# EAGLE design chipdoino (EAGLE 7.7.0)
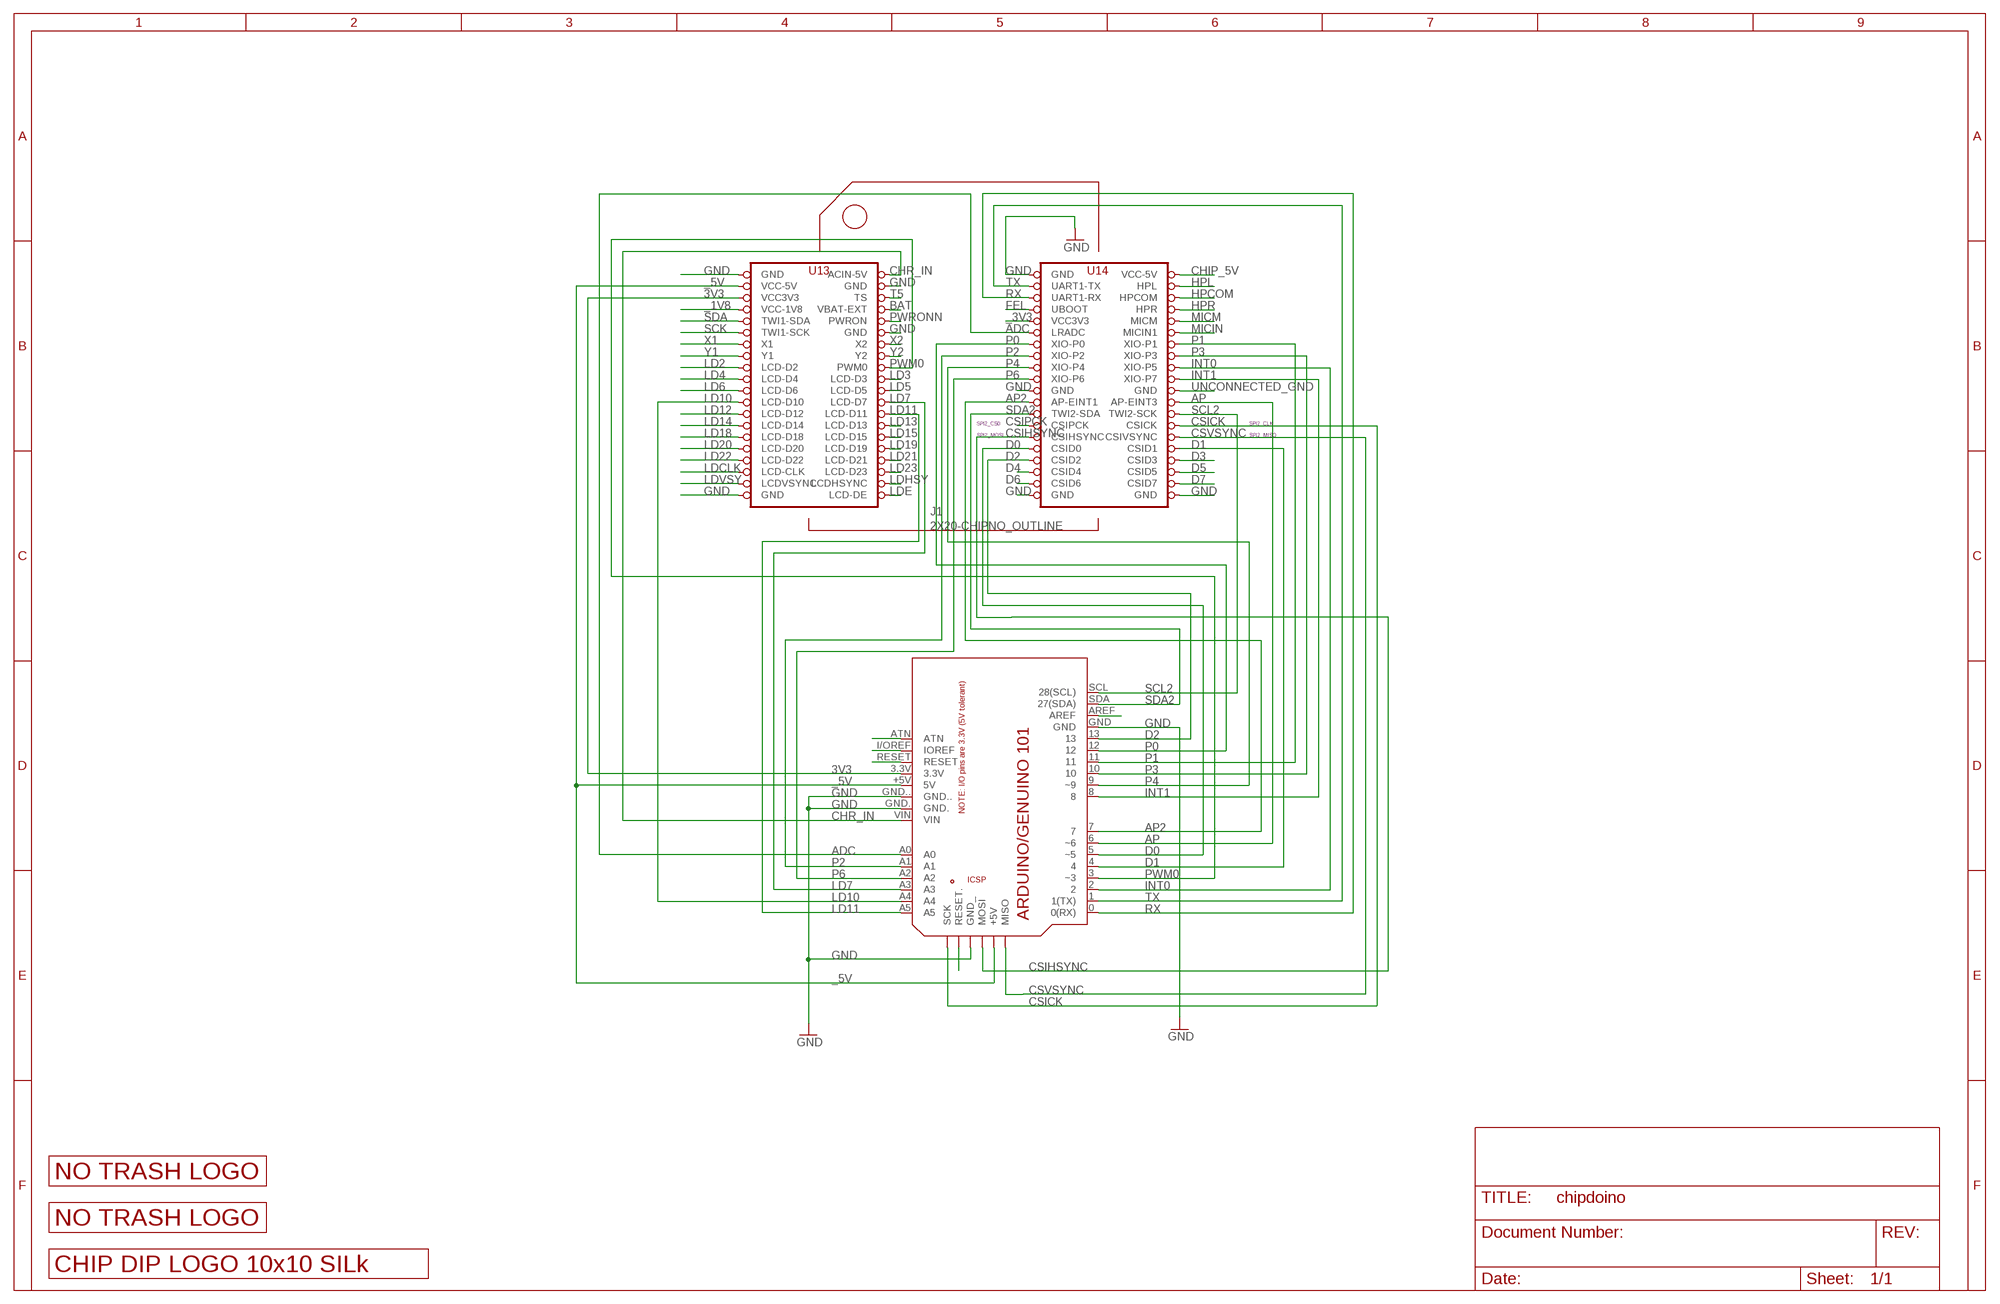
[diagram p0: schematic, sheet 1]

## Parts
J1  2X20-CHIPNO_OUTLINE  [2X20CHIP-TH_NO_OUTLINE]
PCB1  ARDUINO_101  [ARDUINO_101_PINSONLY]
U$2  LOGO_10X10_SILK  [LOGO2_10X10_SILK]
U$3  LOGO_NO_TRASHNO_TRASH  [LOGO_ROHS_NO_TRASH]
U$4  LOGO_NO_TRASHROHS  [LOGO_ROHS_SYM]

## Nets
3V3: J1.VCC3V3 PCB1.3.3V
_1V8: J1.VCC1V8(VCC-1V8)
_3V3: J1.VCC3V3@1(VCC3V3)
_5V: J1.VCC5V@0(VCC-5V) PCB1.5V(+5V) PCB1.+5V(5V)
ADC: J1.LRADC PCB1.A0
AP: J1.AP-EINT3 PCB1.6(~6)
AP2: J1.AP-EINT1 PCB1.7
BAT: J1.BAT(VBAT-EXT)
CHIP_5V: J1.VCC5V@1(VCC-5V)
CHR_IN: J1.CHG-IN(ACIN-5V) PCB1.VIN
CSICK: J1.CSICK PCB1.SCK
CSIHSYNC: J1.CSIHSYNC PCB1.MOSI
CSIPCK: J1.CSIPCK
CSVSYNC: J1.CSIVSYNC PCB1.MISO
D0: J1.CSID0 PCB1.5(~5)
D1: J1.CSID1 PCB1.4
D2: J1.CSID2 PCB1.13
D3: J1.CSID3
D4: J1.CSID4
D5: J1.CSID5
D6: J1.CSID6
D7: J1.CSID7
FEL: J1.FEL(UBOOT)
GND [gnd]: J1.GND@1(GND) J1.GND@2(GND) J1.GND@3(GND) J1.GND@4(GND) J1.GND@5(GND) J1.GND@6(GND) J1.GND@8(GND) J1.GND@10(GND) PCB1.GND PCB1.GND. PCB1.GND.. PCB1.GND_
HPCOM: J1.HPCOM
HPL: J1.HPL
HPR: J1.HPR
INT0: J1.XIO-P5 PCB1.2
INT1: J1.XIO-P7 PCB1.8
LD2: J1.LCD-D2
LD3: J1.LCD-D3
LD4: J1.LCD-D4
LD5: J1.LCD-D5
LD6: J1.LCD-D6
LD7: J1.LCD-D7 PCB1.A3
LD10: J1.LCD-D10 PCB1.A4
LD11: J1.LCD-D11 PCB1.A5
LD12: J1.LCD-D12
LD13: J1.LCD-D13
LD14: J1.LCD-D14
LD15: J1.LCD-D15
LD18: J1.LCD-D18
LD19: J1.LCD-D19
LD20: J1.LCD-D20
LD21: J1.LCD-D21
LD22: J1.LCD-D22
LD23: J1.LCD-D23
LDCLK: J1.LCD-CLK
LDE: J1.LCD-DE
LDHSY: J1.LCD-HSYNC(LCDHSYNC)
LDVSY: J1.LCD-VSYNC(LCDVSYNC)
MICIN: J1.MICIN1
MICM: J1.MICM
N$16: PCB1.AREF
N$30: PCB1.RESET
N$31: PCB1.I/OREF(IOREF)
N$32: PCB1.ATN
N$38: PCB1.RESET.
P0: J1.XIO-P0 PCB1.12
P1: J1.XIO-P1 PCB1.11
P2: J1.XIO-P2 PCB1.A1
P3: J1.XIO-P3 PCB1.10
P4: J1.XIO-P4 PCB1.9(~9)
P6: J1.XIO-P6 PCB1.A2
PWM0: J1.PWM0 PCB1.3(~3)
PWRONN: J1.PWRON
RX: J1.UART1-RX PCB1.0(0(RX))
SCK: J1.TWI1-SCK
SCL2: J1.TWI2-SCK PCB1.SCL(28(SCL))
SDA: J1.TWI1-SDA
SDA2: J1.TWI2-SDA PCB1.SDA(27(SDA))
T5: J1.TS
TX: J1.UART1-TX PCB1.1(1(TX))
UNCONNECTED_GND: J1.GND@7(GND)
X1: J1.X1
X2: J1.X2
Y1: J1.Y1
Y2: J1.Y2

## Notes on the sheet
- SPI2_CS0 | SPI2_CLK
- SPI2_MOSI | SPI2_MISO

## Library data of the parts
J1 = JKW_CHIP:2X20-CHIP: Chip header
PCB1 = E14_Arduino_revC:ARDUINO_101: Schematic symbol for representing an Arduino/Genuino 101 board in an EAGLE schematic. Created by Dave Young for Element14. More 101 documentation at: https://www.element14.com/community/docs/DOC-80459/l/intel-genuino-101-development-board More EAGLE documentation at: http://www.element14.com/community/community/knode/cadsoft_eagle
U$2 = JKW_CHIP:LOGO_10X10_SILK
U$3 U$4 = JKW_CHIP:LOGO_NO_TRASH

## Net classes
1 power: width 0.61 mm, drill 0.61 mm, clearance 0.254 mm
2 gnd: width 0.305 mm, drill 0.559 mm, clearance 0.254 mm
3 usbvcc: width 0.508 mm, drill 0.61 mm, clearance 0.254 mm
4 aref: width 0.406 mm, drill 0.61 mm, clearance 0.254 mm

## Board
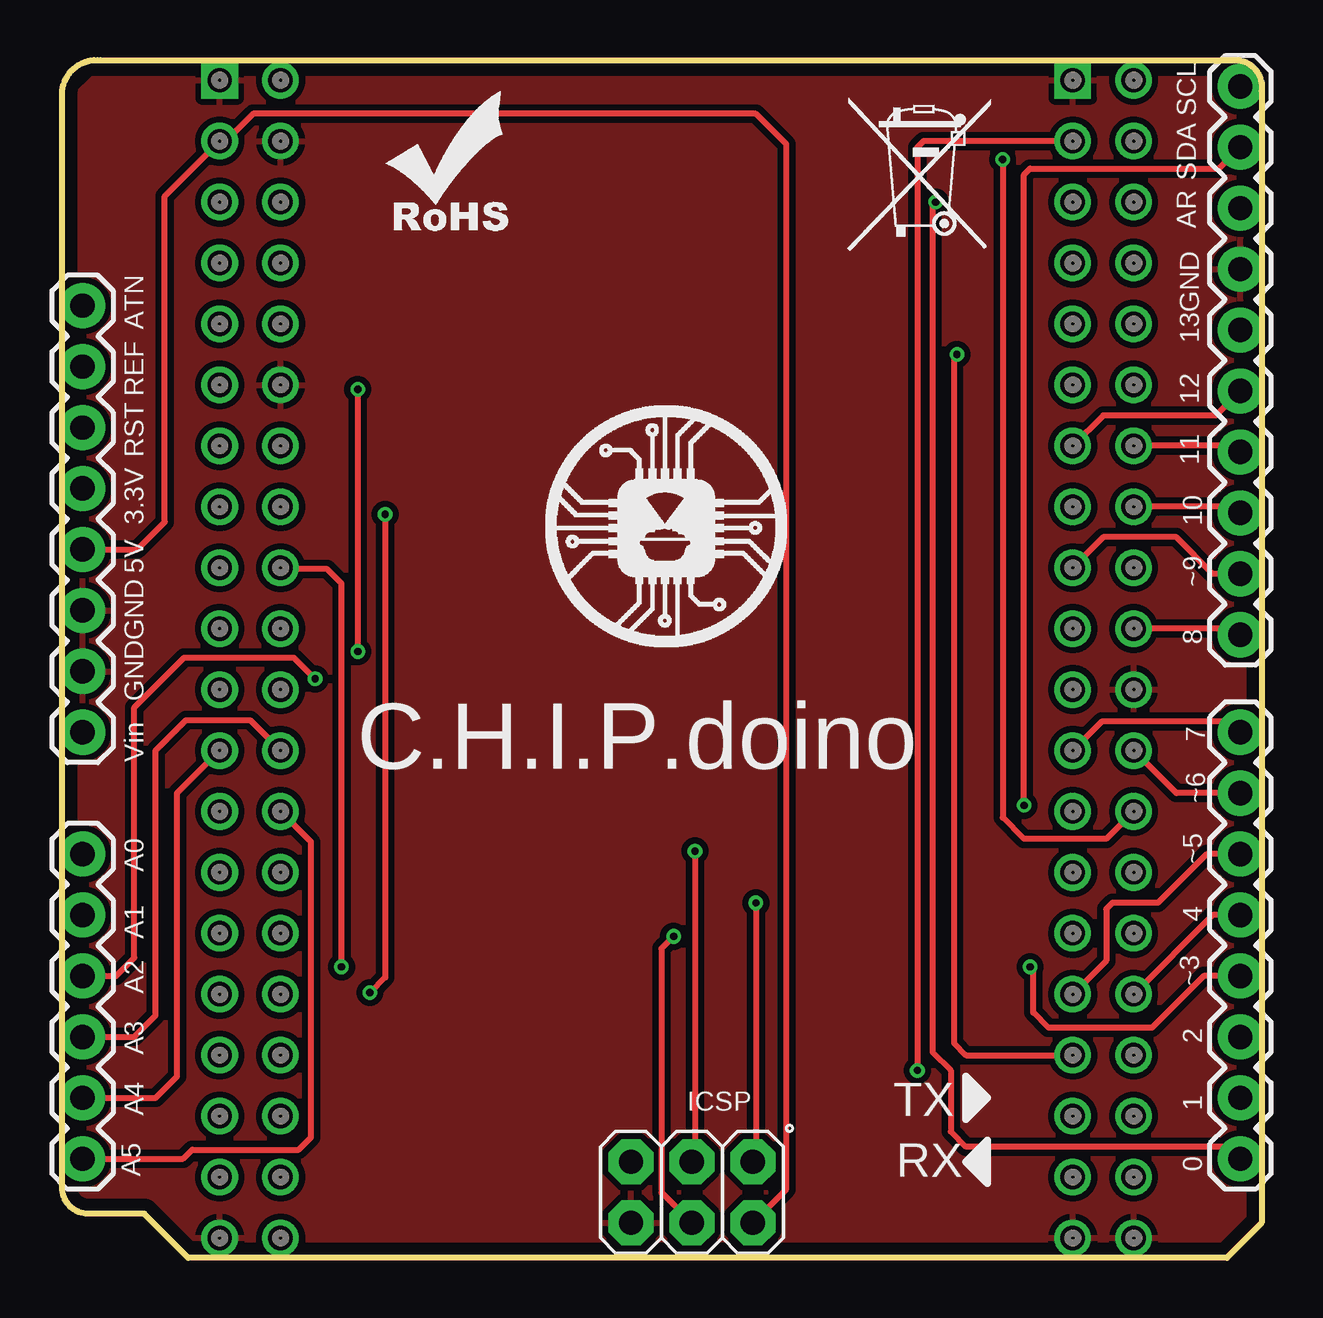
[diagram p1: board, top side]
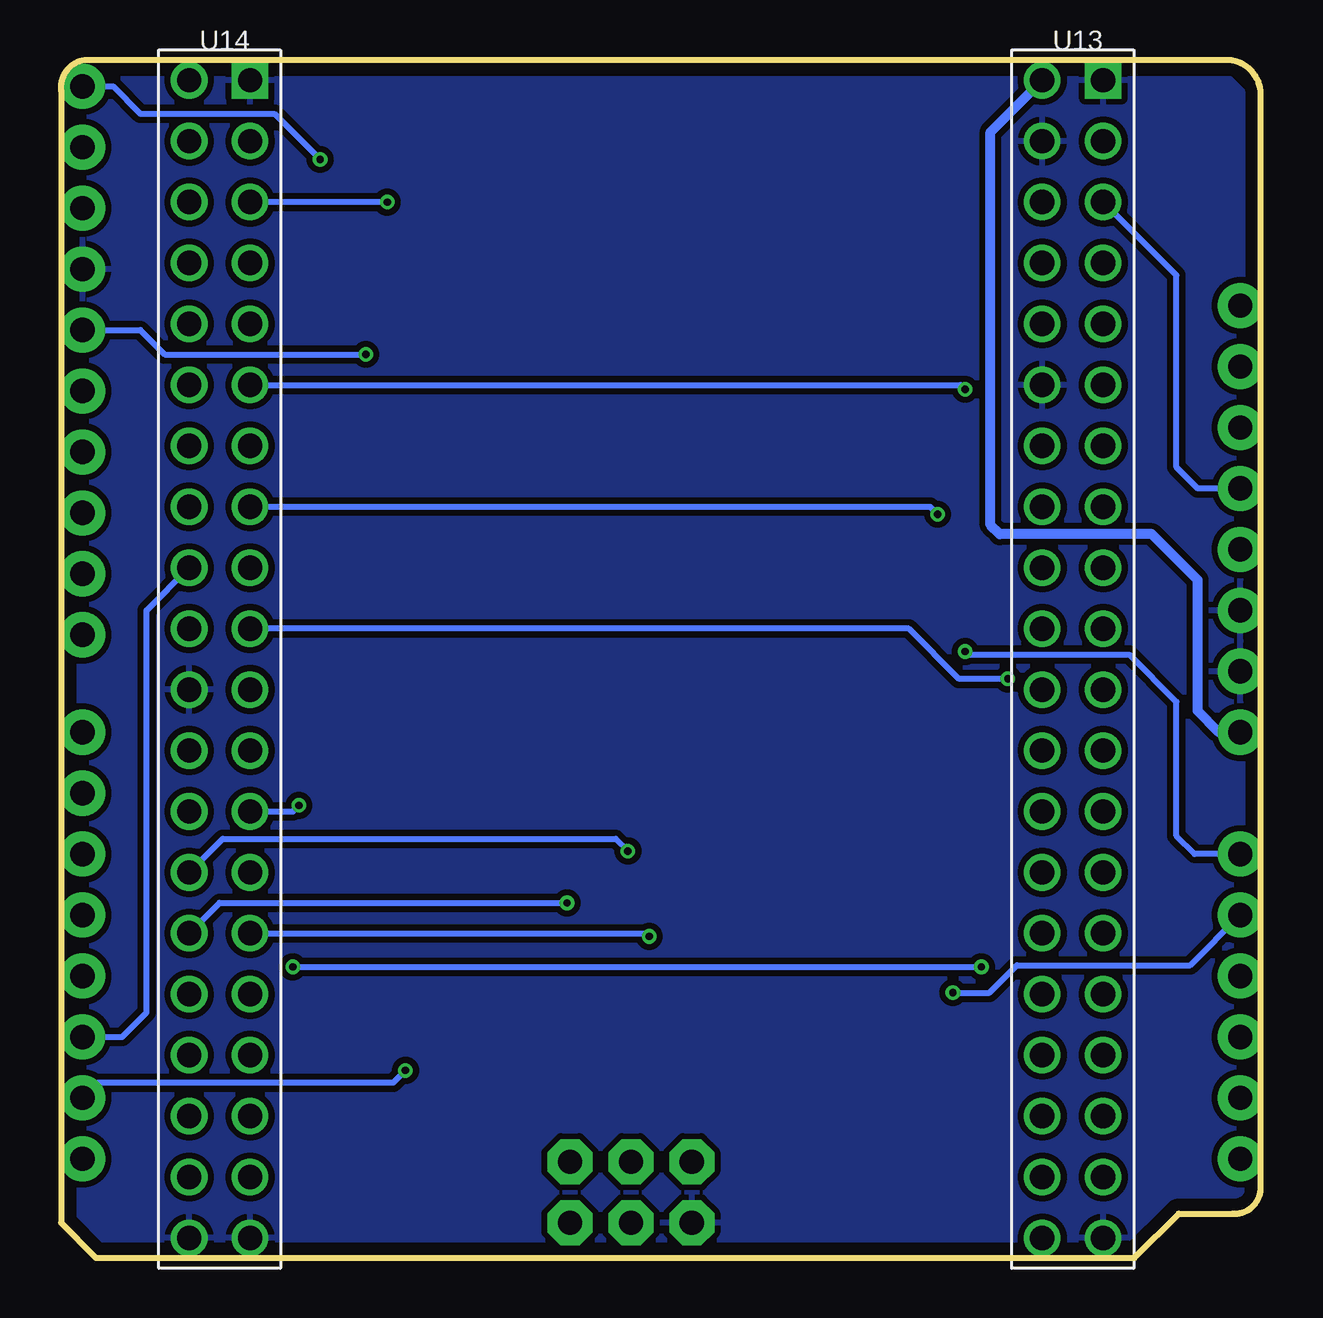
[diagram p2: board, bottom side, seen from below]

Size 50.01 x 49.93 mm. Coordinates in mm from the lower left corner, seen from the top.
Outline: 50,1.46 48.55,0 5.26,0 3.42,1.84 1.18,1.84 arc-90 0,2.84 0,48.63 arc-90 1.6,49.92 49.02,49.92 arc-90 50,48.63 50,1.46
Copper layers (1*16): Top 0.035mm / dielectric 1.6mm / Bottom 0.035mm
Design rules "Elecrow_2-layer_PCB_eagle_rule": minimum track width 6mil, minimum drill 12mil, track to track 6mil, track to pad 6mil, pad to pad 6mil, via to via 8mil, smd to smd 0mil, copper to edge 20mil, drill to drill 10mil, minimum pad ring 6mil, minimum via ring 6mil, stop-mask expansion 0mil, vias tented up to drill 100mil, thermal gap 10mil

### Footprints (pad centres in the part's own frame; a part is rotated, then mirrored left to right if it is on the bottom)
2X20CHIP-TH_NO_OUTLINE = drill 1.016: AP-EINT1 16.51,-5.08; AP-EINT3 19.05,-5.08; BAT -16.51,15.24; CHG-IN -16.51,22.86; CSICK 19.05,-10.16; CSID0 16.51,-15.24; CSID1 19.05,-15.24; CSID2 16.51,-17.78; CSID3 19.05,-17.78; CSID4 16.51,-20.32; CSID5 19.05,-20.32; CSID6 16.51,-22.86; CSID7 19.05,-22.86; CSIHSYNC 16.51,-12.7; CSIPCK 16.51,-10.16; CSIVSYNC 19.05,-12.7; FEL 16.51,15.24; GND@1 -16.51,10.16; GND@2 -19.05,-25.4; GND@4 19.05,-2.54; GND@5 19.05,-25.4; GND@6 16.51,-25.4; GND@7 16.51,-2.54; GND@10 -16.51,20.32; HPCOM 19.05,17.78; HPL 19.05,20.32; HPR 19.05,15.24; LCD-CLK -19.05,-20.32; LCD-D2 -19.05,2.54; LCD-D3 -16.51,0; LCD-D4 -19.05,0; LCD-D5 -16.51,-2.54; LCD-D6 -19.05,-2.54; LCD-D7 -16.51,-5.08; LCD-D10 -19.05,-5.08; LCD-D11 -16.51,-7.62; LCD-D12 -19.05,-7.62; LCD-D13 -16.51,-10.16; LCD-D14 -19.05,-10.16; LCD-D15 -16.51,-12.7; LCD-D18 -19.05,-12.7; LCD-D19 -16.51,-15.24; LCD-D20 -19.05,-15.24; LCD-D21 -16.51,-17.78; LCD-D22 -19.05,-17.78; LCD-D23 -16.51,-20.32; LCD-DE -16.51,-25.4; LCD-HSYNC -16.51,-22.86; LCD-VSYNC -19.05,-22.86; LRADC 16.51,10.16; MICIN1 19.05,10.16; MICM 19.05,12.7; PWM0 -16.51,2.54; PWRON -16.51,12.7; TS -16.51,17.78; TWI1-SCK -19.05,10.16; TWI1-SDA -19.05,12.7; TWI2-SCK 19.05,-7.62; TWI2-SDA 16.51,-7.62; UART1-RX 16.51,17.78; UART1-TX 16.51,20.32; VCC1V8 -19.05,15.24; VCC3V3 -19.05,17.78; VCC3V3@1 16.51,12.7; VCC5V@0 -19.05,20.32; VCC5V@1 19.05,22.86; X1 -19.05,7.62; X2 -16.51,7.62; XIO-P0 16.51,7.62; XIO-P1 19.05,7.62; XIO-P2 16.51,5.08; XIO-P3 19.05,5.08; XIO-P4 16.51,2.54; XIO-P5 19.05,2.54; XIO-P6 16.51,0; XIO-P7 19.05,0; Y1 -19.05,5.08; Y2 -16.51,5.08 | drill 1.016 square: GND@3 -19.05,22.86; GND@8 16.51,22.86
ARDUINO_101_PINSONLY = drill 1.016 pad 1.88: 0 21.59,24.13; 1 19.05,24.13; 2 16.51,24.13; 3 13.97,24.13; 3.3V -6.35,-24.13; 4 11.43,24.13; 5 8.89,24.13; 5V -3.81,-24.13; 6 6.35,24.13; 7 3.81,24.13; 8 -0.254,24.13; 9 -2.794,24.13; 10 -5.334,24.13; 11 -7.874,24.13; 12 -10.414,24.13; 13 -12.954,24.13; A0 8.89,-24.13; A1 11.43,-24.13; A2 13.97,-24.13; A3 16.51,-24.13; A4 19.05,-24.13; A5 21.59,-24.13; AREF -18.034,24.13; ATN -13.97,-24.13; GND -15.494,24.13; GND. 1.27,-24.13; GND.. -1.27,-24.13; I/OREF -11.43,-24.13; RESET -8.89,-24.13; SCL -23.114,24.13; SDA -20.574,24.13; VIN 3.81,-24.13 | drill 1.016 pad 1.88 octagon: +5V 24.257,3.81; GND_ 24.257,-1.27; MISO 21.717,3.81; MOSI 24.257,1.27; RESET. 21.717,-1.27; SCK 21.717,1.27

### Placement (x,y rotation side)
J1  25.61,26.22 0 top
PCB1  24.98,25.72 270 top
U$2  20.15,25.46 0 top
U$3  32.73,41.97 0 top
U$4  13.04,42.73 0 top

### Tracks (layer width: path | path; a pad name or v marks a point on that pad's centre or on a via)
3V3
  Bottom 0.254: PCB1.3.3V 2.63,32.07 3.52,32.95 3.52,40.96 J1.VCC3V3
_5V
  Top 0.254: PCB1.+5V 30.18,2.86 30.18,46.42 28.91,47.69 7.96,47.69 6.82,46.54 J1.VCC5V@0 4.28,44.26 4.28,30.67 3.13,29.53 PCB1.5V
ADC  (via drill 0.3)
  Top 0.254: v12.32,36.2 v12.32,25.27
  Bottom 0.254: PCB1.A0 2.75,16.83 3.52,17.59 3.52,23.18 5.49,25.15 10.16,25.15 10.67,25.15 12.19,25.15 v12.32,25.27 | J1.LRADC 12.51,36.38 v12.32,36.2
AP
  Top 0.254: PCB1.6 46.44,19.37 J1.AP-EINT3
AP2
  Top 0.254: PCB1.7 48.66,22.35 43.33,22.35 J1.AP-EINT1
CHR_IN
  Bottom 0.406: PCB1.VIN 1.74,21.91 2.63,22.8 2.63,28.26 4.53,30.16 10.88,30.16 11.26,30.54 11.26,46.92 J1.CHG-IN
CSICK  (via drill 0.3)
  Top 0.254: v26.38,16.95 26.38,4.13 PCB1.SCK
  Bottom 0.254: J1.CSICK 43.27,17.46 26.88,17.46 v26.38,16.95
CSIHSYNC  (via drill 0.3)
  Top 0.254: v25.49,13.4 24.98,12.89 24.98,2.73 PCB1.MOSI
  Bottom 0.254: J1.CSIHSYNC 25.61,13.52 v25.49,13.4
CSVSYNC  (via drill 0.3)
  Top 0.254: v28.91,14.79 28.91,4.13 PCB1.MISO
  Bottom 0.254: J1.CSIVSYNC 43.39,14.79 v28.91,14.79
D0
  Top 0.254: PCB1.5 47.71,16.83 45.68,14.79 43.77,14.79 43.52,14.54 43.52,12.38 J1.CSID0
D1
  Top 0.254: PCB1.4 47.97,14.29 J1.CSID1
D2  (via drill 0.3)
  Top 0.254: v37.3,37.65 37.17,37.53 37.17,8.95 37.68,8.44 J1.CSID2
  Bottom 0.254: PCB1.13 46.7,38.67 45.68,37.65 v37.3,37.65
GND
  pour Top (isolate 0.254): 0.59,48.45 1.36,49.21 49.11,49.34 49.49,48.96 49.49,1.71 48.35,0.57 5.67,0.57 3.9,2.35 1.1,2.35 0.47,2.98
  pour Bottom (isolate 0.254): 0.59,48.45 1.36,49.21 49.11,49.21 49.49,48.83 49.49,1.84 48.35,0.7 5.42,0.7 3.64,2.48 0.85,2.48 0.59,2.73
INT0
  Bottom 0.254: PCB1.2 47.46,9.21 46.44,10.22 46.44,26.99 J1.XIO-P5
INT1
  Top 0.254: PCB1.8 48.85,26.22 J1.XIO-P7
LD7
  Top 0.254: PCB1.A3 3.01,9.21 3.9,10.1 3.9,21.14 5.17,22.41 7.83,22.41 J1.LCD-D7
LD10
  Top 0.254: PCB1.A4 3.9,6.67 4.79,7.55 4.79,19.37 J1.LCD-D10
LD11
  Top 0.254: PCB1.A5 5.04,4.13 5.42,4.51 9.87,4.51 10.37,5.01 10.37,17.33 J1.LCD-D11
P0
  Top 0.254: PCB1.12 48.09,35.11 43.39,35.11 J1.XIO-P0
P1
  Top 0.254: PCB1.11 48.85,33.84 J1.XIO-P1
P2  (via drill 0.3)
  Top 0.254: v13.46,30.99 13.46,11.68 v12.83,11.05
  Bottom 0.254: J1.XIO-P2 13.78,31.3 v13.46,30.99 | v12.83,11.05 11.3,11.05 10.16,12.19 2.94,12.19 PCB1.A1
P3
  Top 0.254: PCB1.10 48.85,31.3 J1.XIO-P3
P4
  Top 0.254: PCB1.9 47.97,28.51 46.44,30.03 43.39,30.03 J1.XIO-P4
P6  (via drill 0.3)
  Top 0.254: PCB1.A2 2.25,11.75 3.01,12.51 3.01,22.95 5.08,25.02 9.65,25.02 v10.54,24.13
  Bottom 0.254: v10.54,24.13 12.57,24.13 14.67,26.22 J1.XIO-P6
PWM0  (via drill 0.3)
  Top 0.254: PCB1.3 47.58,11.75 45.42,9.59 41.11,9.59 40.47,10.22 40.47,12 v40.34,12.13 | v11.64,12.13 11.64,28.11 11.05,28.7 9.16,28.7 J1.PWM0
  Bottom 0.254: v40.34,12.13 v11.64,12.13
RX  (via drill 0.3)
  Top 0.254: PCB1.0 48.6,4.63 37.68,4.63 37.04,5.27 37.04,7.81 36.28,8.57 36.28,43.88 v36.41,44
  Bottom 0.254: v36.41,44 J1.UART1-RX
SCL2  (via drill 0.3)
  Top 0.254: v39.2,45.78 39.2,18.35 40.09,17.46 43.52,17.46 J1.TWI2-SCK
  Bottom 0.254: PCB1.SCL 47.84,48.83 46.7,47.69 41.11,47.69 v39.2,45.78
SDA2  (via drill 0.3)
  Top 0.254: v40.09,18.86 40.09,45.15 40.34,45.4 48.22,45.4 PCB1.SDA
  Bottom 0.254: J1.TWI2-SDA 40.34,18.6 v40.09,18.86
TX  (via drill 0.3)
  Top 0.254: J1.UART1-TX 35.9,46.54 35.65,46.29 v35.65,7.81
  Bottom 0.254: v35.65,7.81 36.15,7.3 48.47,7.3 PCB1.1

### Text on the board
tNames: C.H.I.P.doino | TX | RX
214bmp: D:/SmartProjects/Snc/a4_bn_logo2.bmp